# Altium schematic sheet Main.SchDoc
size A4; SheetNumber: 1; SheetTotal: 1
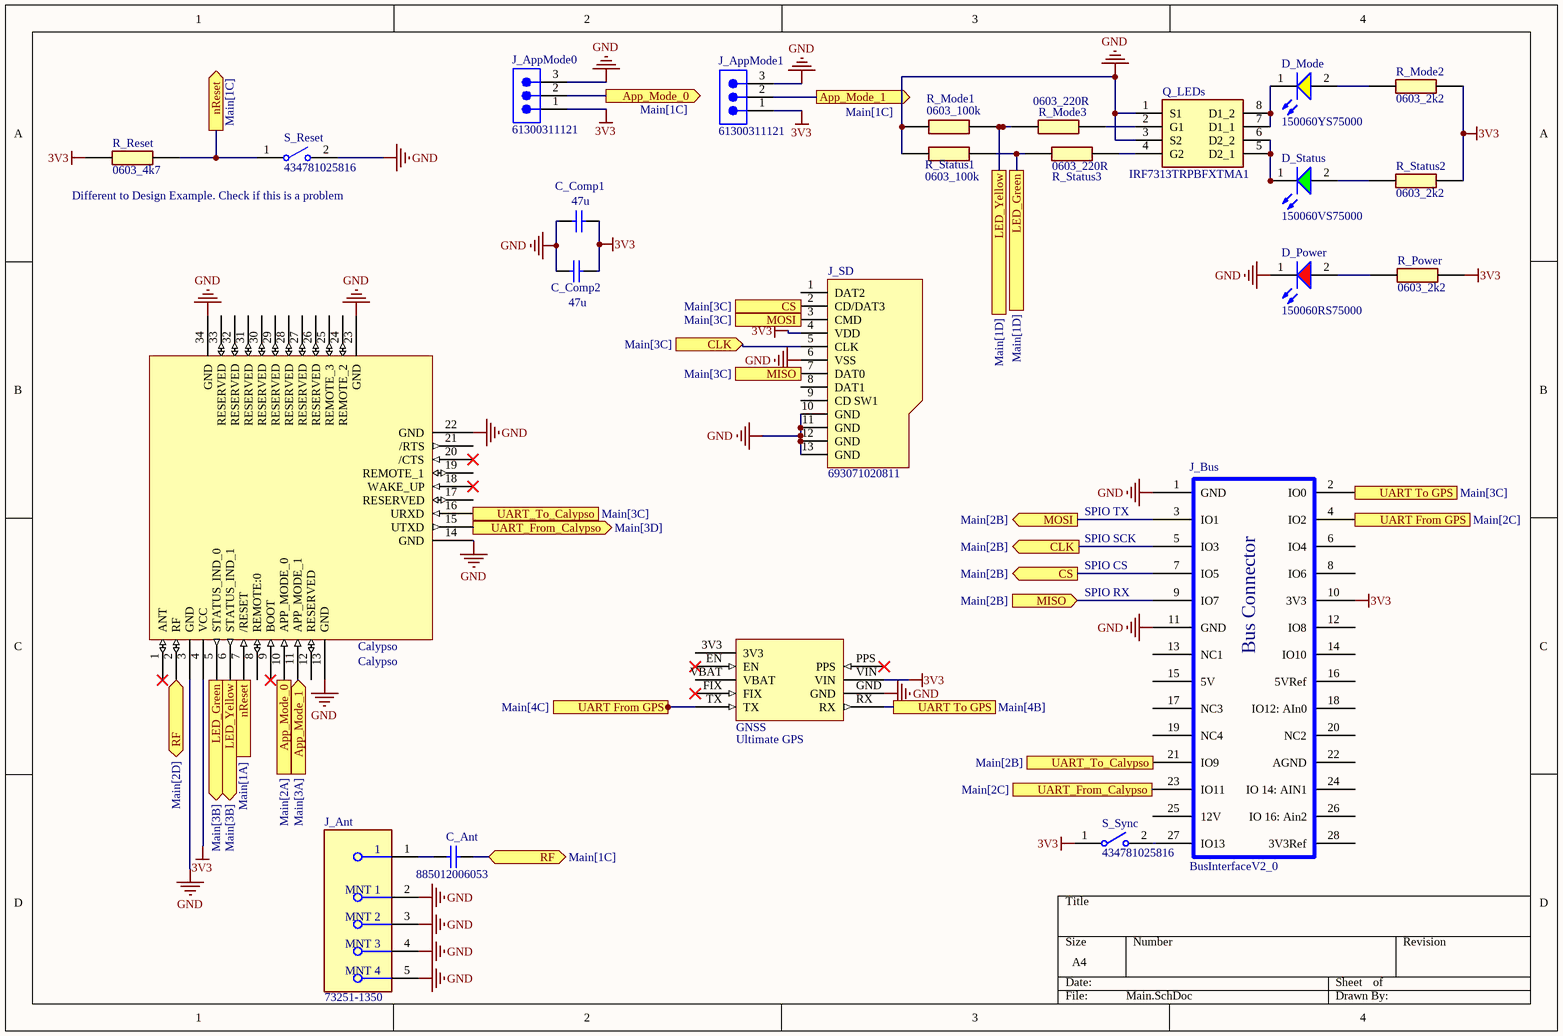
[diagram p0: Main.SchDoc]

## Parts
C_Ant  885012006053  [WCAP-CSGP_0603_L1.6W0.8H0.8_Wave]
C_Comp1  47u  [WCAP-CSGP_1210_L3.2W2.5H2.5]
C_Comp2  47u  [WCAP-CSGP_1210_L3.2W2.5H2.5]
Calypso  Calypso  [Calypso-Footprint-1]
D_Mode  150060YS75000  [WL-SMCW_0603_150060xx75000]
D_Power  150060RS75000  [WL-SMCW_0603_150060xx75000]
D_Status  150060VS75000  [WL-SMCW_0603_150060xx75000]
GNSS  Ultimate GPS  [Ultimate GPS-Footprint-1]
J_Ant  73251-1350  [FP-73251-1350-MFG]
J_AppMode0  61300311121  [61300311121]
J_AppMode1  61300311121  [61300311121]
J_Bus  BusInterfaceV2_0  [BusInterfaceV2_0]
J_SD  693071020811  [693071020811]
Q_LEDs  IRF7313TRPBFXTMA1  [SOIC127P600X175-8N]
R_Mode1  0603_100k  [R_0603]
R_Mode2  0603_2k2  [R_0603]
R_Mode3  0603_220R  [R_0603]
R_Power  0603_2k2  [R_0603]
R_Reset  0603_4k7  [R_0603]
R_Status1  0603_100k  [R_0603]
R_Status2  0603_2k2  [R_0603]
R_Status3  0603_220R  [R_0603]
S_Reset  434781025816  [WS-TASV_L6.2W4.1H2.5_4347x10258x6]
S_Sync  434781025816  [WS-TASV_L6.2W4.1H2.5_4347x10258x6]

## Ports
App_Mode_0 (in, see Main[2A]), App_Mode_0 (out, see Main[1C]), App_Mode_1 (in, see Main[3A]), App_Mode_1 (out, see Main[1C]), CLK (in, see Main[3C]), CLK (out, see Main[2B]), CS (in, see Main[3C]), CS (out, see Main[2B]), LED_Green (out, see Main[3B]), LED_Green (see Main[1D]), LED_Yellow (out, see Main[3B]), LED_Yellow (see Main[1D]), MISO (in, see Main[2B]), MISO (out, see Main[3C]), MOSI (in, see Main[3C]), MOSI (out, see Main[2B]), nReset (in, see Main[1A]), nReset (out, see Main[1C]), RF (bidir, see Main[1C]), RF (bidir, see Main[2D]), UART From GPS (see Main[2C]), UART From GPS (see Main[4C]), UART To GPS (see Main[3C]), UART To GPS (see Main[4B]), UART_From_Calypso (out, see Main[3D]), UART_From_Calypso (see Main[2C]), UART_To_Calypso (in, see Main[3C]), UART_To_Calypso (out, see Main[2B])

## Nets
3V3: C_Comp1.2 C_Comp2.2 Calypso.4(VCC) GNSS.VIN J_AppMode0.1 J_AppMode1.1 J_Bus.10(3V3) J_SD.4(VDD) R_Mode2.2 R_Power.2 R_Reset.1 R_Status2.2 S_Sync.1
GND: C_Comp1.1 C_Comp2.1 Calypso.3(GND) Calypso.13(GND) Calypso.14(GND) Calypso.22(GND) Calypso.23(GND) Calypso.34(GND) D_Power.1(K) GNSS.GND J_Ant.2(MNT_1) J_Ant.3(MNT_2) J_Ant.4(MNT_3) J_Ant.5(MNT_4) J_AppMode0.3 J_AppMode1.3 J_Bus.1(GND) J_Bus.11(GND) J_SD.6(VSS) J_SD.10(GND) J_SD.11(GND) J_SD.12(GND) J_SD.13(GND) Q_LEDs.1(S1) Q_LEDs.3(S2) R_Mode1.1 R_Status1.1 S_Reset.2
App_Mode_0: Calypso.10(APP_MODE_0) J_AppMode0.2 ; port App_Mode_0
App_Mode_1: Calypso.11(APP_MODE_1) J_AppMode1.2 ; port App_Mode_1
CLK: J_Bus.5(IO3) J_SD.5(CLK) ; port CLK
CS: J_Bus.7(IO5) J_SD.2(CD/DAT3) ; port CS
LED_Green: Calypso.5(STATUS_IND_0) R_Status1.2 R_Status3.1 ; port LED_Green
LED_Yellow: Calypso.6(STATUS_IND_1) R_Mode1.2 R_Mode3.1 ; port LED_Yellow
MISO: J_Bus.9(IO7) J_SD.7(DAT0) ; port MISO
MOSI: J_Bus.3(IO1) J_SD.3(CMD) ; port MOSI
nReset: Calypso.7(/RESET) R_Reset.2 S_Reset.1 ; port nReset
RF: C_Ant.1 Calypso.2(RF) ; port RF
UART From GPS: GNSS.TX J_Bus.4(IO2) ; port UART From GPS
UART To GPS: GNSS.RX J_Bus.2(IO0) ; port UART To GPS
UART_From_Calypso: Calypso.15(UTXD) J_Bus.23(IO11) ; port UART_From_Calypso
UART_To_Calypso: Calypso.16(URXD) J_Bus.21(IO9) ; port UART_To_Calypso
NetC_Ant_2: C_Ant.2 J_Ant.1
NetD_Mode_1: D_Mode.1(K) Q_LEDs.7(D1_1) Q_LEDs.8(D1_2)
NetD_Mode_2: D_Mode.2(A) R_Mode2.1
NetD_Power_2: D_Power.2(A) R_Power.1
NetD_Status_1: D_Status.1(K) Q_LEDs.5(D2_1) Q_LEDs.6(D2_2)
NetD_Status_2: D_Status.2(A) R_Status2.1
NetJ_Bus_27: J_Bus.27(IO13) S_Sync.2
NetQ_LEDs_2: Q_LEDs.2(G1) R_Mode3.2
NetQ_LEDs_4: Q_LEDs.4(G2) R_Status3.2

Not connected (* = marked no-connect by the designer): Calypso 1(ANT)* 8(REMOTE:0) 9(BOOT)* 12(RESERVED) 17(RESERVED) 18(WAKE_UP)* 19(REMOTE_1) 20(/CTS)* 21(/RTS) 24(REMOTE_2) 25(REMOTE_3) 26(RESERVED) 27(RESERVED) 28(RESERVED) 29(RESERVED) 30(RESERVED) 31(RESERVED) 32(RESERVED) 33(RESERVED); GNSS 3V3 EN* FIX* PPS* VBAT; J_Bus 6(IO4) 8(IO6) 12(IO8) 13(NC1) 14(IO10) 15(5V) 16(5VRef) 17(NC3) 18(IO12:_AIn0) 19(NC4) 20(NC2) 22(AGND) 24(IO_14:_AIN1) 25(12V) 26(IO_16:_Ain2) 28(3V3Ref); J_SD 1(DAT2) 8(DAT1) 9(CD_SW1)

## Notes on the sheet
- Different to Design Example. Check if this is a problem
- SPIO TX
- SPIO SCK
- SPIO CS
- SPIO RX
- (in symbol CMP-012-000011-1) Bus Connector

## Library data of the parts
C_Ant = CMP-006-000022-1: WCAP-CSGP Multilayer Ceramic Chip Capacitor, General Purpose, size 0603, NP0, 22pF, 50VDC; Manufacturer: Wurth Elektronik; Rated Voltage (DC): 50V; Q Factor: 840; Insulation Resistance: 10GOhm; Capacitance Tolerance: +/-5%; Case/Size Code: 0603; Technical Reference: NP00603220J050DFCT10000; Height: 0.8mm; Pin Count: 2; Source: DefaultCeramicCaps.SchLib; Ceramic Type: NP0; Component Type: Standard; ComponentLink2URL: https://www.we-online.com/redexpert/spec/885012006053?ad; Operating Temperature Max: 125°C; Category: Multilayer Ceramic Chip Capacitors; ComponentLink1Description: Website Link; Width: 0.8mm; Operating Temperature Min: -55°C; Manufacturer Part Number: 885012006053; Length: 1.6mm; ComponentLink1URL: https://www.we-online.com/redexpert/article/885012006053?ad; Capacitance: 22pF; Design Item ID: 885012006053; Match Code: WCAP-CSGP; ComponentLink2Description: Datasheet Link; Mount: Surface Mount; Packaging: Tape and Reel
C_Comp1 C_Comp2 = CMP-006-000009-1: WCAP-CSGP Multilayer Ceramic Chip Capacitor, General Purpose, size 1210, X5R, 47uF, 16VDC; Manufacturer: Wurth Elektronik; Manufacturer Part Number: 885012109011; Case/Size Code: 1210; Insulation Resistance: 0.002GOhm; Rated Voltage (DC): 16V; Capacitance: 47µF; Technical Reference: X5R1210476M016DFCT10000; Dissipation Factor: 10%; Capacitance Tolerance: +/-20%; ComponentLink2URL: https://www.we-online.com/redexpert/spec/885012109011?ad; Component Type: Standard; Width: 2.5mm; Packaging: Tape and Reel; Pin Count: 2; Category: Multilayer Ceramic Chip Capacitors; Mount: Surface Mount; ComponentLink2Description: Datasheet Link; ComponentLink1URL: https://www.we-online.com/redexpert/article/885012109011?ad; Operating Temperature Max: 85°C; Operating Temperature Min: -55°C; ComponentLink1Description: Website Link; Source: DefaultCeramicCaps.SchLib; Ceramic Type: X5R; Design Item ID: 885012109011; Height: 2.5mm; Length: 3.2mm; Match Code: WCAP-CSGP
Calypso = CMP-002-000002-4: WIRL-WIFS Calypso WIFI module; MF-PartNumber: 2610011025000; Manufacturer: Wuerth Elektronik; MF: Würth; Pin Count: 34; Source: https://www.we-online.com/components/products/datasheet/2610011025000.pdf; Manufacturer Part Number: 2610011025000
D_Mode = CMP-008-000003-1: WL-SMCW Mono-color Chip LED Waterclear, size 0603, Yellow, 2V, 140°; Manufacturer: Wurth Elektronik; Case/Size Code: 0603; Peak Wavelength: 595nm; Dominant Wavelength: 590nm; Luminous Intensity: 120mcd; Chip Technology: AlInGaP; ComponentLink2Description: Datasheet Link; Height: 0.7mm; Source: Diodes.SchLib; Design Item ID: 150060YS75000; Match Code: WL-SMCW; Forward Voltage: 2V; Viewing Angle: 140°; Category: Signal LEDs; Pin Count: 2; ComponentLink2URL: https://www.we-online.com/redexpert/spec/150060YS75000?ad; Emitting Color: Yellow; Mount: Surface Mount; Length: 1.6mm; Packaging: Tape and Reel; ComponentLink1URL: https://www.we-online.com/redexpert/article/150060YS75000?ad; Component Type: Standard; Manufacturer Part Number: 150060YS75000; Operating Temperature Min: -40°C; ComponentLink1Description: Website Link; Width: 0.8mm; Operating Temperature Max: 85°C
D_Power = CMP-008-000001-1: WL-SMCW Mono-color Chip LED Waterclear, size 0603, Red, 2V, 140°; Manufacturer: Wurth Elektronik; Case/Size Code: 0603; Dominant Wavelength: 625nm; Peak Wavelength: 630nm; Luminous Intensity: 250mcd; Chip Technology: AlInGaP; Packaging: Tape and Reel; Mount: Surface Mount; Emitting Color: Red; Pin Count: 2; Category: Signal LEDs; Design Item ID: 150060RS75000; Operating Temperature Min: -40°C; Viewing Angle: 140°; ComponentLink1URL: https://www.we-online.com/redexpert/article/150060RS75000?ad; Forward Voltage: 2V; Width: 0.8mm; ComponentLink2Description: Datasheet Link; Source: Diodes.SchLib; Height: 0.7mm; Operating Temperature Max: 85°C; Length: 1.6mm; Match Code: WL-SMCW; Component Type: Standard; Manufacturer Part Number: 150060RS75000; ComponentLink1Description: Website Link; ComponentLink2URL: https://www.we-online.com/redexpert/spec/150060RS75000?ad
D_Status = CMP-008-000002-1: WL-SMCW Mono-color Chip LED Waterclear, size 0603, Bright Green, 2V, 140°; Manufacturer: Wurth Elektronik; Chip Technology: AlInGaP; Luminous Intensity: 40mcd; Peak Wavelength: 572nm; Dominant Wavelength: 570nm; Case/Size Code: 0603; Category: Signal LEDs; Operating Temperature Max: 85°C; Mount: Surface Mount; Component Type: Standard; Pin Count: 2; Height: 0.7mm; Manufacturer Part Number: 150060VS75000; Forward Voltage: 2V; Length: 1.6mm; ComponentLink2Description: Datasheet Link; Packaging: Tape and Reel; ComponentLink1URL: https://www.we-online.com/redexpert/article/150060VS75000?ad; Source: Diodes.SchLib; Operating Temperature Min: -40°C; Emitting Color: Bright Green; Design Item ID: 150060VS75000; ComponentLink2URL: https://www.we-online.com/redexpert/spec/150060VS75000?ad; Viewing Angle: 140°; ComponentLink1Description: Website Link; Width: 0.8mm; Match Code: WL-SMCW
GNSS = CMP-002-000003-1: GPS Board by adafruit; Manufacturer Part Number: 746; Manufacturer: Adafruit
J_Ant = CMP-04764-000006-1: CONN SMA JACK STR 50 OHM SMD; Manufacturer: Molex; Is Female: yes; Standoff Height: 0.41mm; Impedance: 50Ω; Number Of Contacts: 1; Conn Orientation: Straight; Voltage Rating: 500V; Shielding: true; Frequency: 18GHz; Package: 73251-1350; Device Class L1: Connectors; Category: Conn; Manufacturer Part Number: 73251-1350; ComponentLink2URL: https://www.molex.com/pdm_docs/sd/732511350_sd.pdf; Automotive: No; Height: 9.655mm; Octopart: https://octopart.com/73251-1350-molex-5414390; Footprint Url: https://forum.upverter.com/uploads/default/original/3X/d/a/daeafa2ce4908d4fc4e49f0b17d7d2c986fce444.pdf; Temperature Range High: +165°C; Device Class L3: unset; Mouser Description: RF Connectors / Coaxial Connectors SMA ST PCB-JCK STD SMT; Lead Free: Yes; Temperature: -65°C to +165°C; RoHS: TRUE; ComponentLink2Description: Datasheet; Device Class L2: RF / Coaxial Connectors; Digikey Description: CONN SMA JACK STR 50 OHM SMD; Contact Material: Gold; Temperature Range Low: -65°C
J_AppMode0 J_AppMode1 = CMP-1502-01062-3: NexarPartId: 32855521; Manufacturer: Wuerth Elektronik; Current Rating: 3A; Voltage Rating: 250V; Number of Positions: 3; Pitch: 2.54mm; Contact Resistance: 20mΩ; Connector Type: Male Pin; Gender: Male; REACH SVHC: Unknown; Packaging: Bulk; Contact Material: Copper; Min Operating Temperature: -40°C; Number of Rows: 1; Orientation: Vertical; RoHS: Compliant; Contact Plating: Gold; Max Operating Temperature: 105°C; Mount: Through Hole; Height: 8.94mm; Operating Supply Voltage: 250V; Number of Pins: 3; Contact Mating Length: 5.9944mm; Number of Contacts: 3; Color: Black; Lead Free: Lead Free; Lead Pitch: 2.54mm; Termination: Solder; Manufacturer Part Number: 61300311121
J_Bus = CMP-012-000011-1: 62202821121 needs to be soldered on the PCB; Manufacturer_Name: Wuerth Elektronik; Source: Ecogenium_Default_SchLibSchLib.SchLib; Pin Count: 28; Component Type: Standard; Manufacturer_Part_Number: 62202821121; Design Item ID: BusInterfaceV2_0; Manufacturer: Wuerth Elektronik; Manufacturer Part Number: 62202821121
J_SD = CMP-03913-107725714-1: 693071020811 Micro Sd Card, Push-Push, 8Pos, Smt Rohs Compliant: Yes; Manufacturer: Wuerth Elektronik; Current Rating: 500mA; Insulation Resistance: 100MΩ; Min Operating Temperature: -40°C; Number of Pins: 8; Packaging: Tape and Reel; RoHS: Compliant; NexarPartId: 107725714; Max Operating Temperature: 85°C; Manufacturer Part Number: 693071020811
Q_LEDs = CMP-012-000004-1: MOSFET PLANAR 40<-<100V / N Channel / Two Channel; Manufacturer_Name: Infineon; Geometry.Height: 1.75mm; Design Item ID: IRF7313TRPBFXTMA1; Mouser Part Number: 726-IRF7313TRPBFXTMA; Arrow Price/Stock: https://www.arrow.com/en/products/irf7313trpbfxtma1/infineon-technologies-ag?region=europe; Component Type: Standard; Arrow Part Number: IRF7313TRPBFXTMA1; Datasheet Link: https://www.mouser.co.uk/datasheet/2/196/Infineon_IRF7313_DataSheet_v01_01_EN-3224007.pdf; Source: ActiveComponents.SchLib; Manufacturer_Part_Number: IRF7313TRPBFXTMA1; Mouser Price/Stock: https://www.mouser.co.uk/ProductDetail/Infineon-Technologies/IRF7313TRPBFXTMA1?qs=1Kr7Jg1SGW%2FUB%252Bqt0Ezjig%3D%3D; Pin Count: 8; Manufacturer: Infineon; Manufacturer Part Number: IRF7313TRPBFXTMA1
R_Mode1 R_Status1 = CMP-010-000001-1: 100k Ohm, 0603.; Manufacturer_Part_Number: 0603WAJ0104T5E; Manufacturer_Name: Royalohm; Geometry.Height: 0.5mm; Arrow Part Number: *; Mouser Price/Stock: *; Pin Count: 2; Source: Resistors.SchLib; Mouser Part Number: *; Design Item ID: 0603_100k; Arrow Price/Stock: *; Component Type: Standard; Manufacturer: Royalohm; Manufacturer Part Number: 0603WAJ0104T5E
R_Mode2 R_Power R_Status2 = CMP-010-000012-1: 2,2k Ohm, 0603.; Manufacturer_Part_Number: 0603WAJ0222T5E; Manufacturer_Name: Royalohm; Geometry.Height: 0.5mm; Pin Count: 2; Source: Resistors.SchLib; Mouser Price/Stock: *; Arrow Part Number: *; Arrow Price/Stock: *; Component Type: Standard; Design Item ID: 0603_2k2; Manufacturer: Royalohm; Manufacturer Part Number: 0603WAJ0222T5E
R_Mode3 R_Status3 = CMP-010-000010-1: 220 Ohm, 0603.; Manufacturer_Name: Royalohm; Manufacturer_Part_Number: 0603WAJ0221T5E; Geometry.Height: 0.5mm; Component Type: Standard; Source: Resistors.SchLib; Design Item ID: 0603_220R; Arrow Part Number: *; Mouser Price/Stock: *; Pin Count: 2; Arrow Price/Stock: *; Manufacturer: Royalohm; Manufacturer Part Number: 0603WAJ0221T5E
R_Reset = CMP-010-000016-1: 4,7k Ohm, 0603.; Manufacturer_Name: Royalohm; Manufacturer_Part_Number: CQ03SAF4701T5E; Geometry.Height: 0.5mm; Pin Count: 2; Source: Resistors.SchLib; Arrow Part Number: *; Component Type: Standard; Mouser Price/Stock: *; Arrow Price/Stock: *; Design Item ID: 0603_4k7; Manufacturer: Royalohm; Manufacturer Part Number: CQ03SAF4701T5E
S_Reset S_Sync = CMP-011-000002-1: WS-TASV SMT IP67 Tact Switch, L6.2 x W4.1 x H2.5mm, 160g, SPST-NO, 12V, 50mA; Manufacturer: Wurth Elektronik; Washable: Yes; Match Code: WS-TASV; ComponentLink1URL: https://www.we-online.com/redexpert/article/434781025816?ad; Width: 4.1mm; Operating Temperature Min: -40°C; ComponentLink2Description: Datasheet Link; Category: Tact Switches; Source: Electromechanical.SchLib; Terminal Material: Copper Alloy; ComponentLink1Description: Website Link; Packaging: Tape and Reel; Manufacturer Part Number: 434781025816; Design Item ID: 434781025816; Operation Force: 160g; Contact Plating: Silver; Rated Voltage (DC): 12V; ComponentLink2URL: https://www.we-online.com/redexpert/spec/434781025816?ad; Mount: Surface Mount; Component Type: Standard; Length: 6.2mm; Rated Current: 50mA; Pin Count: 2; Terminal Plating: Silver; Contact Material: Stainless Steel; Operating Temperature Max: 85°C; Height: 2.5mm; Circuit: SPST-NO